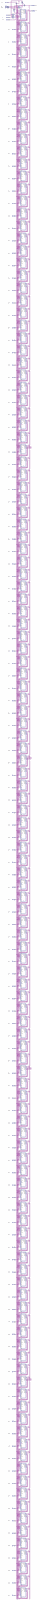
[diagram p0: schematic sheet, whole]
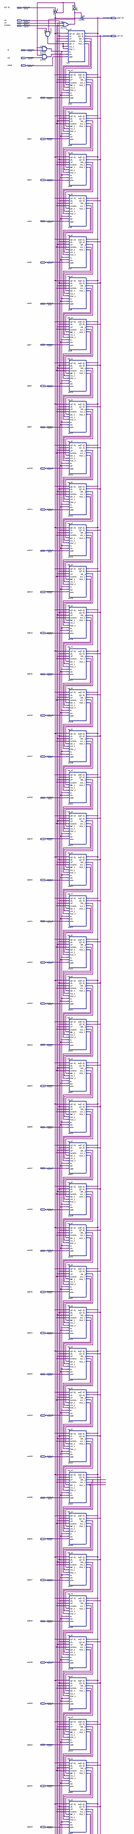
[diagram p1: schematic sheet, upper part]
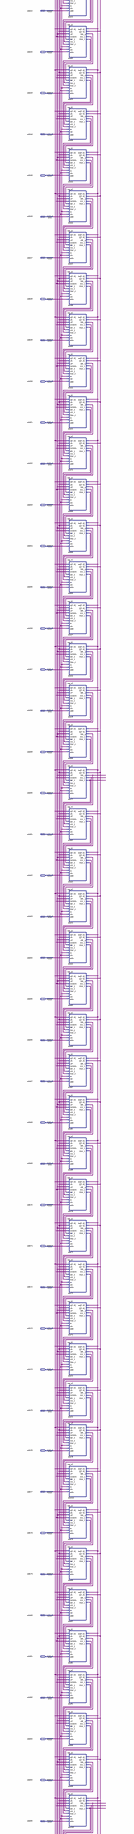
[diagram p2: schematic sheet, middle part]
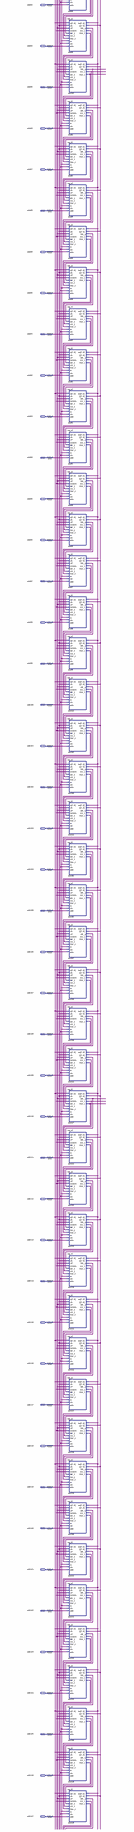
[diagram p3: schematic sheet, lower part]
// Quartus schematic rambuff.bdf as structural Verilog: 135 symbols, 136 pins
module rambuff (
  input  [7:0] in,
  input  clk,
  input  UP,
  input  DOWN,
  input  io,
  input  me,
  input  addr0,
  input  addr1,
  input  addr2,
  input  addr3,
  input  addr4,
  input  addr5,
  input  addr6,
  input  addr7,
  input  addr8,
  input  addr9,
  input  addr10,
  input  addr11,
  input  addr12,
  input  addr13,
  input  addr14,
  input  addr15,
  input  addr16,
  input  addr17,
  input  addr18,
  input  addr19,
  input  addr20,
  input  addr21,
  input  addr22,
  input  addr23,
  input  addr24,
  input  addr25,
  input  addr26,
  input  addr27,
  input  addr28,
  input  addr29,
  input  addr30,
  input  addr31,
  input  addr32,
  input  addr33,
  input  addr34,
  input  addr35,
  input  addr36,
  input  addr37,
  input  addr38,
  input  addr39,
  input  addr40,
  input  addr41,
  input  addr42,
  input  addr43,
  input  addr44,
  input  addr45,
  input  addr46,
  input  addr47,
  input  addr48,
  input  addr49,
  input  addr50,
  input  addr51,
  input  addr52,
  input  addr53,
  input  addr54,
  input  addr55,
  input  addr56,
  input  addr57,
  input  addr58,
  input  addr59,
  input  addr60,
  input  addr61,
  input  addr62,
  input  addr63,
  input  addr64,
  input  addr65,
  input  addr66,
  input  addr67,
  input  addr68,
  input  addr69,
  input  addr70,
  input  addr71,
  input  addr72,
  input  addr73,
  input  addr74,
  input  addr75,
  input  addr76,
  input  addr77,
  input  addr78,
  input  addr79,
  input  addr80,
  input  addr81,
  input  addr82,
  input  addr83,
  input  addr84,
  input  addr85,
  input  addr86,
  input  addr87,
  input  addr88,
  input  addr89,
  input  addr90,
  input  addr91,
  input  addr92,
  input  addr93,
  input  addr94,
  input  addr95,
  input  addr96,
  input  addr97,
  input  addr98,
  input  addr99,
  input  addr100,
  input  addr101,
  input  addr102,
  input  addr103,
  input  addr104,
  input  addr105,
  input  addr106,
  input  addr107,
  input  addr108,
  input  addr109,
  input  addr110,
  input  addr111,
  input  addr112,
  input  addr113,
  input  addr114,
  input  addr115,
  input  addr116,
  input  addr117,
  input  addr118,
  input  addr119,
  input  addr120,
  input  addr121,
  input  addr122,
  input  addr123,
  input  addr124,
  input  addr125,
  input  addr126,
  input  addr127,
  output [7:0] out,
  output [7:0] Q
);

  wire inst2_out, inst3_ad_1, inst3_me_1, inst3_rw_1, inst4_ad_1, inst4_me_1, inst4_rw_1, inst5_ad_1,
       inst5_me_1, inst5_rw_1, inst6_ad_1, inst6_me_1, inst6_rw_1, inst7_ad_1, inst7_me_1, inst7_rw_1,
       inst8_ad_1, inst8_me_1, inst8_rw_1, inst9_ad_1, inst9_me_1, inst9_rw_1, inst10_ad_1, inst10_me_1,
       inst10_rw_1, inst11_ad_1, inst11_me_1, inst11_rw_1, inst12_ad_1, inst12_me_1, inst12_rw_1,
       inst13_ad_1, inst13_me_1, inst13_rw_1, inst14_ad_1, inst14_me_1, inst14_rw_1, inst15_ad_1,
       inst15_me_1, inst15_rw_1, inst16_ad_1, inst16_me_1, inst16_rw_1, inst17_ad_1, inst17_me_1,
       inst17_rw_1, inst18_ad_1, inst18_me_1, inst18_rw_1, inst19_ad_1, inst19_me_1, inst19_rw_1,
       inst20_ad_1, inst20_me_1, inst20_rw_1, inst21_ad_1, inst21_me_1, inst21_rw_1, inst22_ad_1,
       inst22_me_1, inst22_rw_1, inst23_ad_1, inst23_me_1, inst23_rw_1, inst24_ad_1, inst24_me_1,
       inst24_rw_1, inst25_ad_1, inst25_me_1, inst25_rw_1, inst26_ad_1, inst26_me_1, inst26_rw_1,
       inst27_ad_1, inst27_me_1, inst27_rw_1, inst28_ad_1, inst28_me_1, inst28_rw_1, inst29_ad_1,
       inst29_me_1, inst29_rw_1, inst30_ad_1, inst30_me_1, inst30_rw_1, inst31_ad_1, inst31_me_1,
       inst31_rw_1, inst32_ad_1, inst32_me_1, inst32_rw_1, inst33_ad_1, inst33_me_1, inst33_rw_1,
       inst34_ad_1, inst34_me_1, inst34_rw_1, inst35_ad_1, inst35_me_1, inst35_rw_1, inst36_ad_1,
       inst36_me_1, inst36_rw_1, inst37_ad_1, inst37_me_1, inst37_rw_1, inst38_ad_1, inst38_me_1,
       inst38_rw_1, inst39_ad_1, inst39_me_1, inst39_rw_1, inst40_ad_1, inst40_me_1, inst40_rw_1,
       inst41_ad_1, inst41_me_1, inst41_rw_1, inst42_ad_1, inst42_me_1, inst42_rw_1, inst43_ad_1,
       inst43_me_1, inst43_rw_1, inst44_ad_1, inst44_me_1, inst44_rw_1, inst45_ad_1, inst45_me_1,
       inst45_rw_1, inst46_ad_1, inst46_me_1, inst46_rw_1, inst47_ad_1, inst47_me_1, inst47_rw_1,
       inst48_ad_1, inst48_me_1, inst48_rw_1, inst49_ad_1, inst49_me_1, inst49_rw_1, inst50_ad_1,
       inst50_me_1, inst50_rw_1, inst51_ad_1, inst51_me_1, inst51_rw_1, inst52_ad_1, inst52_me_1,
       inst52_rw_1, inst53_ad_1, inst53_me_1, inst53_rw_1, inst54_ad_1, inst54_me_1, inst54_rw_1,
       inst55_ad_1, inst55_me_1, inst55_rw_1, inst56_ad_1, inst56_me_1, inst56_rw_1, inst57_ad_1,
       inst57_me_1, inst57_rw_1, inst58_ad_1, inst58_me_1, inst58_rw_1, inst59_ad_1, inst59_me_1,
       inst59_rw_1, inst60_ad_1, inst60_me_1, inst60_rw_1, inst61_ad_1, inst61_me_1, inst61_rw_1,
       inst62_ad_1, inst62_me_1, inst62_rw_1, inst63_ad_1, inst63_me_1, inst63_rw_1, inst64_ad_1,
       inst64_me_1, inst64_rw_1, inst65_ad_1, inst65_me_1, inst65_rw_1, inst66_ad_1, inst66_me_1,
       inst66_rw_1, inst67_ad_1, inst67_me_1, inst67_rw_1, inst68_ad_1, inst68_me_1, inst68_rw_1,
       inst69_ad_1, inst69_me_1, inst69_rw_1, inst70_ad_1, inst70_me_1, inst70_rw_1, inst71_ad_1,
       inst71_me_1, inst71_rw_1, inst72_ad_1, inst72_me_1, inst72_rw_1, inst73_ad_1, inst73_me_1,
       inst73_rw_1, inst74_ad_1, inst74_me_1, inst74_rw_1, inst75_ad_1, inst75_me_1, inst75_rw_1,
       inst76_ad_1, inst76_me_1, inst76_rw_1, inst77_ad_1, inst77_me_1, inst77_rw_1, inst78_ad_1,
       inst78_me_1, inst78_rw_1, inst79_ad_1, inst79_me_1, inst79_rw_1, inst80_ad_1, inst80_me_1,
       inst80_rw_1, inst81_ad_1, inst81_me_1, inst81_rw_1, inst82_ad_1, inst82_me_1, inst82_rw_1,
       inst83_ad_1, inst83_me_1, inst83_rw_1, inst84_ad_1, inst84_me_1, inst84_rw_1, inst85_ad_1,
       inst85_me_1, inst85_rw_1, inst86_ad_1, inst86_me_1, inst86_rw_1, inst87_ad_1, inst87_me_1,
       inst87_rw_1, inst88_ad_1, inst88_me_1, inst88_rw_1, inst89_ad_1, inst89_me_1, inst89_rw_1,
       inst90_ad_1, inst90_me_1, inst90_rw_1, inst91_ad_1, inst91_me_1, inst91_rw_1, inst92_ad_1,
       inst92_me_1, inst92_rw_1, inst93_ad_1, inst93_me_1, inst93_rw_1, inst94_ad_1, inst94_me_1,
       inst94_rw_1, inst95_ad_1, inst95_me_1, inst95_rw_1, inst96_ad_1, inst96_me_1, inst96_rw_1,
       inst97_ad_1, inst97_me_1, inst97_rw_1, inst98_ad_1, inst98_me_1, inst98_rw_1, inst99_ad_1,
       inst99_me_1, inst99_rw_1, inst100_ad_1, inst100_me_1, inst100_rw_1, inst101_ad_1, inst101_me_1,
       inst101_rw_1, inst102_ad_1, inst102_me_1, inst102_rw_1, inst103_ad_1, inst103_me_1, inst103_rw_1,
       inst104_ad_1, inst104_me_1, inst104_rw_1, inst105_ad_1, inst105_me_1, inst105_rw_1, inst106_ad_1,
       inst106_me_1, inst106_rw_1, inst107_ad_1, inst107_me_1, inst107_rw_1, inst108_ad_1, inst108_me_1,
       inst108_rw_1, inst109_ad_1, inst109_me_1, inst109_rw_1, inst110_ad_1, inst110_me_1, inst110_rw_1,
       inst111_ad_1, inst111_me_1, inst111_rw_1, inst112_ad_1, inst112_me_1, inst112_rw_1, inst113_ad_1,
       inst113_me_1, inst113_rw_1, inst114_ad_1, inst114_me_1, inst114_rw_1, inst115_ad_1, inst115_me_1,
       inst115_rw_1, inst116_ad_1, inst116_me_1, inst116_rw_1, inst117_ad_1, inst117_me_1, inst117_rw_1,
       inst118_ad_1, inst118_me_1, inst118_rw_1, inst119_ad_1, inst119_me_1, inst119_rw_1, inst120_ad_1,
       inst120_me_1, inst120_rw_1, inst121_ad_1, inst121_me_1, inst121_rw_1, inst122_ad_1, inst122_me_1,
       inst122_rw_1, inst123_ad_1, inst123_me_1, inst123_rw_1, inst124_ad_1, inst124_me_1, inst124_rw_1,
       inst125_ad_1, inst125_me_1, inst125_rw_1, inst126_ad_1, inst126_me_1, inst126_rw_1, inst127_ad_1,
       inst127_me_1, inst127_rw_1, inst128_ad_1, inst128_me_1, inst128_rw_1, inst129_ad_1, inst129_me_1,
       inst129_rw_1, inst131_out, inst133_out, inst136_out, inst137_out, inst_ad_1, inst_me_1, inst_rw_1;
  wire [7:0] inst134_out;

  and inst2 (inst2_out, inst131_out, inst133_out);
  and inst136 (inst136_out, inst133_out, io);
  and inst137 (inst137_out, inst133_out, me);
  TRI inst134[7:0] (.IN(in), .OE(inst133_out), .OUT(inst134_out));
  or inst131 (inst131_out, UP, DOWN);
  not inst133 (inst133_out, inst131_out);
  tag_e1 inst (
    .in(inst134_out), .clk(clk), .UP(UP), .DOWN(DOWN), .ME_2(inst2_out), .AD_2(inst2_out), .RW_2(inst2_out),
    .io(inst136_out), .me(inst137_out), .addr(addr0), .out(out), .Q(Q), .ME_1(inst_me_1), .AD_1(inst_ad_1),
    .RW_1(inst_rw_1));
  tag_e1 inst3 (
    .in(inst134_out), .clk(clk), .UP(UP), .DOWN(DOWN), .ME_2(inst_me_1), .AD_2(inst_ad_1), .RW_2(inst_rw_1),
    .io(inst136_out), .me(inst137_out), .addr(addr1), .out(out), .Q(Q), .ME_1(inst3_me_1), .AD_1(inst3_ad_1),
    .RW_1(inst3_rw_1));
  tag_e1 inst4 (
    .in(inst134_out), .clk(clk), .UP(UP), .DOWN(DOWN), .ME_2(inst3_me_1), .AD_2(inst3_ad_1),
    .RW_2(inst3_rw_1), .io(inst136_out), .me(inst137_out), .addr(addr2), .out(out), .Q(Q), .ME_1(inst4_me_1),
    .AD_1(inst4_ad_1), .RW_1(inst4_rw_1));
  tag_e1 inst5 (
    .in(inst134_out), .clk(clk), .UP(UP), .DOWN(DOWN), .ME_2(inst4_me_1), .AD_2(inst4_ad_1),
    .RW_2(inst4_rw_1), .io(inst136_out), .me(inst137_out), .addr(addr3), .out(out), .Q(Q), .ME_1(inst5_me_1),
    .AD_1(inst5_ad_1), .RW_1(inst5_rw_1));
  tag_e1 inst6 (
    .in(inst134_out), .clk(clk), .UP(UP), .DOWN(DOWN), .ME_2(inst5_me_1), .AD_2(inst5_ad_1),
    .RW_2(inst5_rw_1), .io(inst136_out), .me(inst137_out), .addr(addr4), .out(out), .Q(Q), .ME_1(inst6_me_1),
    .AD_1(inst6_ad_1), .RW_1(inst6_rw_1));
  tag_e1 inst7 (
    .in(inst134_out), .clk(clk), .UP(UP), .DOWN(DOWN), .ME_2(inst6_me_1), .AD_2(inst6_ad_1),
    .RW_2(inst6_rw_1), .io(inst136_out), .me(inst137_out), .addr(addr5), .out(out), .Q(Q), .ME_1(inst7_me_1),
    .AD_1(inst7_ad_1), .RW_1(inst7_rw_1));
  tag_e1 inst8 (
    .in(inst134_out), .clk(clk), .UP(UP), .DOWN(DOWN), .ME_2(inst7_me_1), .AD_2(inst7_ad_1),
    .RW_2(inst7_rw_1), .io(inst136_out), .me(inst137_out), .addr(addr6), .out(out), .Q(Q), .ME_1(inst8_me_1),
    .AD_1(inst8_ad_1), .RW_1(inst8_rw_1));
  tag_e1 inst9 (
    .in(inst134_out), .clk(clk), .UP(UP), .DOWN(DOWN), .ME_2(inst8_me_1), .AD_2(inst8_ad_1),
    .RW_2(inst8_rw_1), .io(inst136_out), .me(inst137_out), .addr(addr7), .out(out), .Q(Q), .ME_1(inst9_me_1),
    .AD_1(inst9_ad_1), .RW_1(inst9_rw_1));
  tag_e1 inst10 (
    .in(inst134_out), .clk(clk), .UP(UP), .DOWN(DOWN), .ME_2(inst9_me_1), .AD_2(inst9_ad_1),
    .RW_2(inst9_rw_1), .io(inst136_out), .me(inst137_out), .addr(addr8), .out(out), .Q(Q),
    .ME_1(inst10_me_1), .AD_1(inst10_ad_1), .RW_1(inst10_rw_1));
  tag_e1 inst11 (
    .in(inst134_out), .clk(clk), .UP(UP), .DOWN(DOWN), .ME_2(inst10_me_1), .AD_2(inst10_ad_1),
    .RW_2(inst10_rw_1), .io(inst136_out), .me(inst137_out), .addr(addr9), .out(out), .Q(Q),
    .ME_1(inst11_me_1), .AD_1(inst11_ad_1), .RW_1(inst11_rw_1));
  tag_e1 inst12 (
    .in(inst134_out), .clk(clk), .UP(UP), .DOWN(DOWN), .ME_2(inst11_me_1), .AD_2(inst11_ad_1),
    .RW_2(inst11_rw_1), .io(inst136_out), .me(inst137_out), .addr(addr10), .out(out), .Q(Q),
    .ME_1(inst12_me_1), .AD_1(inst12_ad_1), .RW_1(inst12_rw_1));
  tag_e1 inst13 (
    .in(inst134_out), .clk(clk), .UP(UP), .DOWN(DOWN), .ME_2(inst12_me_1), .AD_2(inst12_ad_1),
    .RW_2(inst12_rw_1), .io(inst136_out), .me(inst137_out), .addr(addr11), .out(out), .Q(Q),
    .ME_1(inst13_me_1), .AD_1(inst13_ad_1), .RW_1(inst13_rw_1));
  tag_e1 inst14 (
    .in(inst134_out), .clk(clk), .UP(UP), .DOWN(DOWN), .ME_2(inst13_me_1), .AD_2(inst13_ad_1),
    .RW_2(inst13_rw_1), .io(inst136_out), .me(inst137_out), .addr(addr12), .out(out), .Q(Q),
    .ME_1(inst14_me_1), .AD_1(inst14_ad_1), .RW_1(inst14_rw_1));
  tag_e1 inst15 (
    .in(inst134_out), .clk(clk), .UP(UP), .DOWN(DOWN), .ME_2(inst14_me_1), .AD_2(inst14_ad_1),
    .RW_2(inst14_rw_1), .io(inst136_out), .me(inst137_out), .addr(addr13), .out(out), .Q(Q),
    .ME_1(inst15_me_1), .AD_1(inst15_ad_1), .RW_1(inst15_rw_1));
  tag_e1 inst16 (
    .in(inst134_out), .clk(clk), .UP(UP), .DOWN(DOWN), .ME_2(inst15_me_1), .AD_2(inst15_ad_1),
    .RW_2(inst15_rw_1), .io(inst136_out), .me(inst137_out), .addr(addr14), .out(out), .Q(Q),
    .ME_1(inst16_me_1), .AD_1(inst16_ad_1), .RW_1(inst16_rw_1));
  tag_e1 inst17 (
    .in(inst134_out), .clk(clk), .UP(UP), .DOWN(DOWN), .ME_2(inst16_me_1), .AD_2(inst16_ad_1),
    .RW_2(inst16_rw_1), .io(inst136_out), .me(inst137_out), .addr(addr15), .out(out), .Q(Q),
    .ME_1(inst17_me_1), .AD_1(inst17_ad_1), .RW_1(inst17_rw_1));
  tag_e1 inst18 (
    .in(inst134_out), .clk(clk), .UP(UP), .DOWN(DOWN), .ME_2(inst17_me_1), .AD_2(inst17_ad_1),
    .RW_2(inst17_rw_1), .io(inst136_out), .me(inst137_out), .addr(addr16), .out(out), .Q(Q),
    .ME_1(inst18_me_1), .AD_1(inst18_ad_1), .RW_1(inst18_rw_1));
  tag_e1 inst19 (
    .in(inst134_out), .clk(clk), .UP(UP), .DOWN(DOWN), .ME_2(inst18_me_1), .AD_2(inst18_ad_1),
    .RW_2(inst18_rw_1), .io(inst136_out), .me(inst137_out), .addr(addr17), .out(out), .Q(Q),
    .ME_1(inst19_me_1), .AD_1(inst19_ad_1), .RW_1(inst19_rw_1));
  tag_e1 inst20 (
    .in(inst134_out), .clk(clk), .UP(UP), .DOWN(DOWN), .ME_2(inst19_me_1), .AD_2(inst19_ad_1),
    .RW_2(inst19_rw_1), .io(inst136_out), .me(inst137_out), .addr(addr18), .out(out), .Q(Q),
    .ME_1(inst20_me_1), .AD_1(inst20_ad_1), .RW_1(inst20_rw_1));
  tag_e1 inst21 (
    .in(inst134_out), .clk(clk), .UP(UP), .DOWN(DOWN), .ME_2(inst20_me_1), .AD_2(inst20_ad_1),
    .RW_2(inst20_rw_1), .io(inst136_out), .me(inst137_out), .addr(addr19), .out(out), .Q(Q),
    .ME_1(inst21_me_1), .AD_1(inst21_ad_1), .RW_1(inst21_rw_1));
  tag_e1 inst22 (
    .in(inst134_out), .clk(clk), .UP(UP), .DOWN(DOWN), .ME_2(inst21_me_1), .AD_2(inst21_ad_1),
    .RW_2(inst21_rw_1), .io(inst136_out), .me(inst137_out), .addr(addr20), .out(out), .Q(Q),
    .ME_1(inst22_me_1), .AD_1(inst22_ad_1), .RW_1(inst22_rw_1));
  tag_e1 inst23 (
    .in(inst134_out), .clk(clk), .UP(UP), .DOWN(DOWN), .ME_2(inst22_me_1), .AD_2(inst22_ad_1),
    .RW_2(inst22_rw_1), .io(inst136_out), .me(inst137_out), .addr(addr21), .out(out), .Q(Q),
    .ME_1(inst23_me_1), .AD_1(inst23_ad_1), .RW_1(inst23_rw_1));
  tag_e1 inst24 (
    .in(inst134_out), .clk(clk), .UP(UP), .DOWN(DOWN), .ME_2(inst23_me_1), .AD_2(inst23_ad_1),
    .RW_2(inst23_rw_1), .io(inst136_out), .me(inst137_out), .addr(addr22), .out(out), .Q(Q),
    .ME_1(inst24_me_1), .AD_1(inst24_ad_1), .RW_1(inst24_rw_1));
  tag_e1 inst25 (
    .in(inst134_out), .clk(clk), .UP(UP), .DOWN(DOWN), .ME_2(inst24_me_1), .AD_2(inst24_ad_1),
    .RW_2(inst24_rw_1), .io(inst136_out), .me(inst137_out), .addr(addr23), .out(out), .Q(Q),
    .ME_1(inst25_me_1), .AD_1(inst25_ad_1), .RW_1(inst25_rw_1));
  tag_e1 inst26 (
    .in(inst134_out), .clk(clk), .UP(UP), .DOWN(DOWN), .ME_2(inst25_me_1), .AD_2(inst25_ad_1),
    .RW_2(inst25_rw_1), .io(inst136_out), .me(inst137_out), .addr(addr24), .out(out), .Q(Q),
    .ME_1(inst26_me_1), .AD_1(inst26_ad_1), .RW_1(inst26_rw_1));
  tag_e1 inst27 (
    .in(inst134_out), .clk(clk), .UP(UP), .DOWN(DOWN), .ME_2(inst26_me_1), .AD_2(inst26_ad_1),
    .RW_2(inst26_rw_1), .io(inst136_out), .me(inst137_out), .addr(addr25), .out(out), .Q(Q),
    .ME_1(inst27_me_1), .AD_1(inst27_ad_1), .RW_1(inst27_rw_1));
  tag_e1 inst28 (
    .in(inst134_out), .clk(clk), .UP(UP), .DOWN(DOWN), .ME_2(inst27_me_1), .AD_2(inst27_ad_1),
    .RW_2(inst27_rw_1), .io(inst136_out), .me(inst137_out), .addr(addr26), .out(out), .Q(Q),
    .ME_1(inst28_me_1), .AD_1(inst28_ad_1), .RW_1(inst28_rw_1));
  tag_e1 inst51 (
    .in(inst134_out), .clk(clk), .UP(UP), .DOWN(DOWN), .ME_2(inst28_me_1), .AD_2(inst28_ad_1),
    .RW_2(inst28_rw_1), .io(inst136_out), .me(inst137_out), .addr(addr27), .out(out), .Q(Q),
    .ME_1(inst51_me_1), .AD_1(inst51_ad_1), .RW_1(inst51_rw_1));
  tag_e1 inst29 (
    .in(inst134_out), .clk(clk), .UP(UP), .DOWN(DOWN), .ME_2(inst51_me_1), .AD_2(inst51_ad_1),
    .RW_2(inst51_rw_1), .io(inst136_out), .me(inst137_out), .addr(addr28), .out(out), .Q(Q),
    .ME_1(inst29_me_1), .AD_1(inst29_ad_1), .RW_1(inst29_rw_1));
  tag_e1 inst30 (
    .in(inst134_out), .clk(clk), .UP(UP), .DOWN(DOWN), .ME_2(inst29_me_1), .AD_2(inst29_ad_1),
    .RW_2(inst29_rw_1), .io(inst136_out), .me(inst137_out), .addr(addr29), .out(out), .Q(Q),
    .ME_1(inst30_me_1), .AD_1(inst30_ad_1), .RW_1(inst30_rw_1));
  tag_e1 inst31 (
    .in(inst134_out), .clk(clk), .UP(UP), .DOWN(DOWN), .ME_2(inst30_me_1), .AD_2(inst30_ad_1),
    .RW_2(inst30_rw_1), .io(inst136_out), .me(inst137_out), .addr(addr30), .out(out), .Q(Q),
    .ME_1(inst31_me_1), .AD_1(inst31_ad_1), .RW_1(inst31_rw_1));
  tag_e1 inst32 (
    .in(inst134_out), .clk(clk), .UP(UP), .DOWN(DOWN), .ME_2(inst31_me_1), .AD_2(inst31_ad_1),
    .RW_2(inst31_rw_1), .io(inst136_out), .me(inst137_out), .addr(addr31), .out(out), .Q(Q),
    .ME_1(inst32_me_1), .AD_1(inst32_ad_1), .RW_1(inst32_rw_1));
  tag_e1 inst33 (
    .in(inst134_out), .clk(clk), .UP(UP), .DOWN(DOWN), .ME_2(inst32_me_1), .AD_2(inst32_ad_1),
    .RW_2(inst32_rw_1), .io(inst136_out), .me(inst137_out), .addr(addr32), .out(out), .Q(Q),
    .ME_1(inst33_me_1), .AD_1(inst33_ad_1), .RW_1(inst33_rw_1));
  tag_e1 inst34 (
    .in(inst134_out), .clk(clk), .UP(UP), .DOWN(DOWN), .ME_2(inst33_me_1), .AD_2(inst33_ad_1),
    .RW_2(inst33_rw_1), .io(inst136_out), .me(inst137_out), .addr(addr33), .out(out), .Q(Q),
    .ME_1(inst34_me_1), .AD_1(inst34_ad_1), .RW_1(inst34_rw_1));
  tag_e1 inst35 (
    .in(inst134_out), .clk(clk), .UP(UP), .DOWN(DOWN), .ME_2(inst34_me_1), .AD_2(inst34_ad_1),
    .RW_2(inst34_rw_1), .io(inst136_out), .me(inst137_out), .addr(addr34), .out(out), .Q(Q),
    .ME_1(inst35_me_1), .AD_1(inst35_ad_1), .RW_1(inst35_rw_1));
  tag_e1 inst52 (
    .in(inst134_out), .clk(clk), .UP(UP), .DOWN(DOWN), .ME_2(inst35_me_1), .AD_2(inst35_ad_1),
    .RW_2(inst35_rw_1), .io(inst136_out), .me(inst137_out), .addr(addr35), .out(out), .Q(Q),
    .ME_1(inst52_me_1), .AD_1(inst52_ad_1), .RW_1(inst52_rw_1));
  tag_e1 inst36 (
    .in(inst134_out), .clk(clk), .UP(UP), .DOWN(DOWN), .ME_2(inst52_me_1), .AD_2(inst52_ad_1),
    .RW_2(inst52_rw_1), .io(inst136_out), .me(inst137_out), .addr(addr36), .out(out), .Q(Q),
    .ME_1(inst36_me_1), .AD_1(inst36_ad_1), .RW_1(inst36_rw_1));
  tag_e1 inst37 (
    .in(inst134_out), .clk(clk), .UP(UP), .DOWN(DOWN), .ME_2(inst36_me_1), .AD_2(inst36_ad_1),
    .RW_2(inst36_rw_1), .io(inst136_out), .me(inst137_out), .addr(addr37), .out(out), .Q(Q),
    .ME_1(inst37_me_1), .AD_1(inst37_ad_1), .RW_1(inst37_rw_1));
  tag_e1 inst38 (
    .in(inst134_out), .clk(clk), .UP(UP), .DOWN(DOWN), .ME_2(inst37_me_1), .AD_2(inst37_ad_1),
    .RW_2(inst37_rw_1), .io(inst136_out), .me(inst137_out), .addr(addr38), .out(out), .Q(Q),
    .ME_1(inst38_me_1), .AD_1(inst38_ad_1), .RW_1(inst38_rw_1));
  tag_e1 inst39 (
    .in(inst134_out), .clk(clk), .UP(UP), .DOWN(DOWN), .ME_2(inst38_me_1), .AD_2(inst38_ad_1),
    .RW_2(inst38_rw_1), .io(inst136_out), .me(inst137_out), .addr(addr39), .out(out), .Q(Q),
    .ME_1(inst39_me_1), .AD_1(inst39_ad_1), .RW_1(inst39_rw_1));
  tag_e1 inst40 (
    .in(inst134_out), .clk(clk), .UP(UP), .DOWN(DOWN), .ME_2(inst39_me_1), .AD_2(inst39_ad_1),
    .RW_2(inst39_rw_1), .io(inst136_out), .me(inst137_out), .addr(addr40), .out(out), .Q(Q),
    .ME_1(inst40_me_1), .AD_1(inst40_ad_1), .RW_1(inst40_rw_1));
  tag_e1 inst41 (
    .in(inst134_out), .clk(clk), .UP(UP), .DOWN(DOWN), .ME_2(inst40_me_1), .AD_2(inst40_ad_1),
    .RW_2(inst40_rw_1), .io(inst136_out), .me(inst137_out), .addr(addr41), .out(out), .Q(Q),
    .ME_1(inst41_me_1), .AD_1(inst41_ad_1), .RW_1(inst41_rw_1));
  tag_e1 inst42 (
    .in(inst134_out), .clk(clk), .UP(UP), .DOWN(DOWN), .ME_2(inst41_me_1), .AD_2(inst41_ad_1),
    .RW_2(inst41_rw_1), .io(inst136_out), .me(inst137_out), .addr(addr42), .out(out), .Q(Q),
    .ME_1(inst42_me_1), .AD_1(inst42_ad_1), .RW_1(inst42_rw_1));
  tag_e1 inst43 (
    .in(inst134_out), .clk(clk), .UP(UP), .DOWN(DOWN), .ME_2(inst42_me_1), .AD_2(inst42_ad_1),
    .RW_2(inst42_rw_1), .io(inst136_out), .me(inst137_out), .addr(addr43), .out(out), .Q(Q),
    .ME_1(inst43_me_1), .AD_1(inst43_ad_1), .RW_1(inst43_rw_1));
  tag_e1 inst44 (
    .in(inst134_out), .clk(clk), .UP(UP), .DOWN(DOWN), .ME_2(inst43_me_1), .AD_2(inst43_ad_1),
    .RW_2(inst43_rw_1), .io(inst136_out), .me(inst137_out), .addr(addr44), .out(out), .Q(Q),
    .ME_1(inst44_me_1), .AD_1(inst44_ad_1), .RW_1(inst44_rw_1));
  tag_e1 inst45 (
    .in(inst134_out), .clk(clk), .UP(UP), .DOWN(DOWN), .ME_2(inst44_me_1), .AD_2(inst44_ad_1),
    .RW_2(inst44_rw_1), .io(inst136_out), .me(inst137_out), .addr(addr45), .out(out), .Q(Q),
    .ME_1(inst45_me_1), .AD_1(inst45_ad_1), .RW_1(inst45_rw_1));
  tag_e1 inst46 (
    .in(inst134_out), .clk(clk), .UP(UP), .DOWN(DOWN), .ME_2(inst45_me_1), .AD_2(inst45_ad_1),
    .RW_2(inst45_rw_1), .io(inst136_out), .me(inst137_out), .addr(addr46), .out(out), .Q(Q),
    .ME_1(inst46_me_1), .AD_1(inst46_ad_1), .RW_1(inst46_rw_1));
  tag_e1 inst47 (
    .in(inst134_out), .clk(clk), .UP(UP), .DOWN(DOWN), .ME_2(inst46_me_1), .AD_2(inst46_ad_1),
    .RW_2(inst46_rw_1), .io(inst136_out), .me(inst137_out), .addr(addr47), .out(out), .Q(Q),
    .ME_1(inst47_me_1), .AD_1(inst47_ad_1), .RW_1(inst47_rw_1));
  tag_e1 inst48 (
    .in(inst134_out), .clk(clk), .UP(UP), .DOWN(DOWN), .ME_2(inst47_me_1), .AD_2(inst47_ad_1),
    .RW_2(inst47_rw_1), .io(inst136_out), .me(inst137_out), .addr(addr48), .out(out), .Q(Q),
    .ME_1(inst48_me_1), .AD_1(inst48_ad_1), .RW_1(inst48_rw_1));
  tag_e1 inst49 (
    .in(inst134_out), .clk(clk), .UP(UP), .DOWN(DOWN), .ME_2(inst48_me_1), .AD_2(inst48_ad_1),
    .RW_2(inst48_rw_1), .io(inst136_out), .me(inst137_out), .addr(addr49), .out(out), .Q(Q),
    .ME_1(inst49_me_1), .AD_1(inst49_ad_1), .RW_1(inst49_rw_1));
  tag_e1 inst50 (
    .in(inst134_out), .clk(clk), .UP(UP), .DOWN(DOWN), .ME_2(inst49_me_1), .AD_2(inst49_ad_1),
    .RW_2(inst49_rw_1), .io(inst136_out), .me(inst137_out), .addr(addr50), .out(out), .Q(Q),
    .ME_1(inst50_me_1), .AD_1(inst50_ad_1), .RW_1(inst50_rw_1));
  tag_e1 inst53 (
    .in(inst134_out), .clk(clk), .UP(UP), .DOWN(DOWN), .ME_2(inst50_me_1), .AD_2(inst50_ad_1),
    .RW_2(inst50_rw_1), .io(inst136_out), .me(inst137_out), .addr(addr51), .out(out), .Q(Q),
    .ME_1(inst53_me_1), .AD_1(inst53_ad_1), .RW_1(inst53_rw_1));
  tag_e1 inst76 (
    .in(inst134_out), .clk(clk), .UP(UP), .DOWN(DOWN), .ME_2(inst53_me_1), .AD_2(inst53_ad_1),
    .RW_2(inst53_rw_1), .io(inst136_out), .me(inst137_out), .addr(addr52), .out(out), .Q(Q),
    .ME_1(inst76_me_1), .AD_1(inst76_ad_1), .RW_1(inst76_rw_1));
  tag_e1 inst54 (
    .in(inst134_out), .clk(clk), .UP(UP), .DOWN(DOWN), .ME_2(inst76_me_1), .AD_2(inst76_ad_1),
    .RW_2(inst76_rw_1), .io(inst136_out), .me(inst137_out), .addr(addr53), .out(out), .Q(Q),
    .ME_1(inst54_me_1), .AD_1(inst54_ad_1), .RW_1(inst54_rw_1));
  tag_e1 inst55 (
    .in(inst134_out), .clk(clk), .UP(UP), .DOWN(DOWN), .ME_2(inst54_me_1), .AD_2(inst54_ad_1),
    .RW_2(inst54_rw_1), .io(inst136_out), .me(inst137_out), .addr(addr54), .out(out), .Q(Q),
    .ME_1(inst55_me_1), .AD_1(inst55_ad_1), .RW_1(inst55_rw_1));
  tag_e1 inst56 (
    .in(inst134_out), .clk(clk), .UP(UP), .DOWN(DOWN), .ME_2(inst55_me_1), .AD_2(inst55_ad_1),
    .RW_2(inst55_rw_1), .io(inst136_out), .me(inst137_out), .addr(addr55), .out(out), .Q(Q),
    .ME_1(inst56_me_1), .AD_1(inst56_ad_1), .RW_1(inst56_rw_1));
  tag_e1 inst57 (
    .in(inst134_out), .clk(clk), .UP(UP), .DOWN(DOWN), .ME_2(inst56_me_1), .AD_2(inst56_ad_1),
    .RW_2(inst56_rw_1), .io(inst136_out), .me(inst137_out), .addr(addr56), .out(out), .Q(Q),
    .ME_1(inst57_me_1), .AD_1(inst57_ad_1), .RW_1(inst57_rw_1));
  tag_e1 inst58 (
    .in(inst134_out), .clk(clk), .UP(UP), .DOWN(DOWN), .ME_2(inst57_me_1), .AD_2(inst57_ad_1),
    .RW_2(inst57_rw_1), .io(inst136_out), .me(inst137_out), .addr(addr57), .out(out), .Q(Q),
    .ME_1(inst58_me_1), .AD_1(inst58_ad_1), .RW_1(inst58_rw_1));
  tag_e1 inst59 (
    .in(inst134_out), .clk(clk), .UP(UP), .DOWN(DOWN), .ME_2(inst58_me_1), .AD_2(inst58_ad_1),
    .RW_2(inst58_rw_1), .io(inst136_out), .me(inst137_out), .addr(addr58), .out(out), .Q(Q),
    .ME_1(inst59_me_1), .AD_1(inst59_ad_1), .RW_1(inst59_rw_1));
  tag_e1 inst60 (
    .in(inst134_out), .clk(clk), .UP(UP), .DOWN(DOWN), .ME_2(inst59_me_1), .AD_2(inst59_ad_1),
    .RW_2(inst59_rw_1), .io(inst136_out), .me(inst137_out), .addr(addr59), .out(out), .Q(Q),
    .ME_1(inst60_me_1), .AD_1(inst60_ad_1), .RW_1(inst60_rw_1));
  tag_e1 inst77 (
    .in(inst134_out), .clk(clk), .UP(UP), .DOWN(DOWN), .ME_2(inst60_me_1), .AD_2(inst60_ad_1),
    .RW_2(inst60_rw_1), .io(inst136_out), .me(inst137_out), .addr(addr60), .out(out), .Q(Q),
    .ME_1(inst77_me_1), .AD_1(inst77_ad_1), .RW_1(inst77_rw_1));
  tag_e1 inst61 (
    .in(inst134_out), .clk(clk), .UP(UP), .DOWN(DOWN), .ME_2(inst77_me_1), .AD_2(inst77_ad_1),
    .RW_2(inst77_rw_1), .io(inst136_out), .me(inst137_out), .addr(addr61), .out(out), .Q(Q),
    .ME_1(inst61_me_1), .AD_1(inst61_ad_1), .RW_1(inst61_rw_1));
  tag_e1 inst62 (
    .in(inst134_out), .clk(clk), .UP(UP), .DOWN(DOWN), .ME_2(inst61_me_1), .AD_2(inst61_ad_1),
    .RW_2(inst61_rw_1), .io(inst136_out), .me(inst137_out), .addr(addr62), .out(out), .Q(Q),
    .ME_1(inst62_me_1), .AD_1(inst62_ad_1), .RW_1(inst62_rw_1));
  tag_e1 inst63 (
    .in(inst134_out), .clk(clk), .UP(UP), .DOWN(DOWN), .ME_2(inst62_me_1), .AD_2(inst62_ad_1),
    .RW_2(inst62_rw_1), .io(inst136_out), .me(inst137_out), .addr(addr63), .out(out), .Q(Q),
    .ME_1(inst63_me_1), .AD_1(inst63_ad_1), .RW_1(inst63_rw_1));
  tag_e1 inst64 (
    .in(inst134_out), .clk(clk), .UP(UP), .DOWN(DOWN), .ME_2(inst63_me_1), .AD_2(inst63_ad_1),
    .RW_2(inst63_rw_1), .io(inst136_out), .me(inst137_out), .addr(addr64), .out(out), .Q(Q),
    .ME_1(inst64_me_1), .AD_1(inst64_ad_1), .RW_1(inst64_rw_1));
  tag_e1 inst65 (
    .in(inst134_out), .clk(clk), .UP(UP), .DOWN(DOWN), .ME_2(inst64_me_1), .AD_2(inst64_ad_1),
    .RW_2(inst64_rw_1), .io(inst136_out), .me(inst137_out), .addr(addr65), .out(out), .Q(Q),
    .ME_1(inst65_me_1), .AD_1(inst65_ad_1), .RW_1(inst65_rw_1));
  tag_e1 inst66 (
    .in(inst134_out), .clk(clk), .UP(UP), .DOWN(DOWN), .ME_2(inst65_me_1), .AD_2(inst65_ad_1),
    .RW_2(inst65_rw_1), .io(inst136_out), .me(inst137_out), .addr(addr66), .out(out), .Q(Q),
    .ME_1(inst66_me_1), .AD_1(inst66_ad_1), .RW_1(inst66_rw_1));
  tag_e1 inst67 (
    .in(inst134_out), .clk(clk), .UP(UP), .DOWN(DOWN), .ME_2(inst66_me_1), .AD_2(inst66_ad_1),
    .RW_2(inst66_rw_1), .io(inst136_out), .me(inst137_out), .addr(addr67), .out(out), .Q(Q),
    .ME_1(inst67_me_1), .AD_1(inst67_ad_1), .RW_1(inst67_rw_1));
  tag_e1 inst68 (
    .in(inst134_out), .clk(clk), .UP(UP), .DOWN(DOWN), .ME_2(inst67_me_1), .AD_2(inst67_ad_1),
    .RW_2(inst67_rw_1), .io(inst136_out), .me(inst137_out), .addr(addr68), .out(out), .Q(Q),
    .ME_1(inst68_me_1), .AD_1(inst68_ad_1), .RW_1(inst68_rw_1));
  tag_e1 inst69 (
    .in(inst134_out), .clk(clk), .UP(UP), .DOWN(DOWN), .ME_2(inst68_me_1), .AD_2(inst68_ad_1),
    .RW_2(inst68_rw_1), .io(inst136_out), .me(inst137_out), .addr(addr69), .out(out), .Q(Q),
    .ME_1(inst69_me_1), .AD_1(inst69_ad_1), .RW_1(inst69_rw_1));
  tag_e1 inst70 (
    .in(inst134_out), .clk(clk), .UP(UP), .DOWN(DOWN), .ME_2(inst69_me_1), .AD_2(inst69_ad_1),
    .RW_2(inst69_rw_1), .io(inst136_out), .me(inst137_out), .addr(addr70), .out(out), .Q(Q),
    .ME_1(inst70_me_1), .AD_1(inst70_ad_1), .RW_1(inst70_rw_1));
  tag_e1 inst71 (
    .in(inst134_out), .clk(clk), .UP(UP), .DOWN(DOWN), .ME_2(inst70_me_1), .AD_2(inst70_ad_1),
    .RW_2(inst70_rw_1), .io(inst136_out), .me(inst137_out), .addr(addr71), .out(out), .Q(Q),
    .ME_1(inst71_me_1), .AD_1(inst71_ad_1), .RW_1(inst71_rw_1));
  tag_e1 inst72 (
    .in(inst134_out), .clk(clk), .UP(UP), .DOWN(DOWN), .ME_2(inst71_me_1), .AD_2(inst71_ad_1),
    .RW_2(inst71_rw_1), .io(inst136_out), .me(inst137_out), .addr(addr72), .out(out), .Q(Q),
    .ME_1(inst72_me_1), .AD_1(inst72_ad_1), .RW_1(inst72_rw_1));
  tag_e1 inst73 (
    .in(inst134_out), .clk(clk), .UP(UP), .DOWN(DOWN), .ME_2(inst72_me_1), .AD_2(inst72_ad_1),
    .RW_2(inst72_rw_1), .io(inst136_out), .me(inst137_out), .addr(addr73), .out(out), .Q(Q),
    .ME_1(inst73_me_1), .AD_1(inst73_ad_1), .RW_1(inst73_rw_1));
  tag_e1 inst74 (
    .in(inst134_out), .clk(clk), .UP(UP), .DOWN(DOWN), .ME_2(inst73_me_1), .AD_2(inst73_ad_1),
    .RW_2(inst73_rw_1), .io(inst136_out), .me(inst137_out), .addr(addr74), .out(out), .Q(Q),
    .ME_1(inst74_me_1), .AD_1(inst74_ad_1), .RW_1(inst74_rw_1));
  tag_e1 inst75 (
    .in(inst134_out), .clk(clk), .UP(UP), .DOWN(DOWN), .ME_2(inst74_me_1), .AD_2(inst74_ad_1),
    .RW_2(inst74_rw_1), .io(inst136_out), .me(inst137_out), .addr(addr75), .out(out), .Q(Q),
    .ME_1(inst75_me_1), .AD_1(inst75_ad_1), .RW_1(inst75_rw_1));
  tag_e1 inst78 (
    .in(inst134_out), .clk(clk), .UP(UP), .DOWN(DOWN), .ME_2(inst75_me_1), .AD_2(inst75_ad_1),
    .RW_2(inst75_rw_1), .io(inst136_out), .me(inst137_out), .addr(addr76), .out(out), .Q(Q),
    .ME_1(inst78_me_1), .AD_1(inst78_ad_1), .RW_1(inst78_rw_1));
  tag_e1 inst101 (
    .in(inst134_out), .clk(clk), .UP(UP), .DOWN(DOWN), .ME_2(inst78_me_1), .AD_2(inst78_ad_1),
    .RW_2(inst78_rw_1), .io(inst136_out), .me(inst137_out), .addr(addr77), .out(out), .Q(Q),
    .ME_1(inst101_me_1), .AD_1(inst101_ad_1), .RW_1(inst101_rw_1));
  tag_e1 inst79 (
    .in(inst134_out), .clk(clk), .UP(UP), .DOWN(DOWN), .ME_2(inst101_me_1), .AD_2(inst101_ad_1),
    .RW_2(inst101_rw_1), .io(inst136_out), .me(inst137_out), .addr(addr78), .out(out), .Q(Q),
    .ME_1(inst79_me_1), .AD_1(inst79_ad_1), .RW_1(inst79_rw_1));
  tag_e1 inst80 (
    .in(inst134_out), .clk(clk), .UP(UP), .DOWN(DOWN), .ME_2(inst79_me_1), .AD_2(inst79_ad_1),
    .RW_2(inst79_rw_1), .io(inst136_out), .me(inst137_out), .addr(addr79), .out(out), .Q(Q),
    .ME_1(inst80_me_1), .AD_1(inst80_ad_1), .RW_1(inst80_rw_1));
  tag_e1 inst81 (
    .in(inst134_out), .clk(clk), .UP(UP), .DOWN(DOWN), .ME_2(inst80_me_1), .AD_2(inst80_ad_1),
    .RW_2(inst80_rw_1), .io(inst136_out), .me(inst137_out), .addr(addr80), .out(out), .Q(Q),
    .ME_1(inst81_me_1), .AD_1(inst81_ad_1), .RW_1(inst81_rw_1));
  tag_e1 inst82 (
    .in(inst134_out), .clk(clk), .UP(UP), .DOWN(DOWN), .ME_2(inst81_me_1), .AD_2(inst81_ad_1),
    .RW_2(inst81_rw_1), .io(inst136_out), .me(inst137_out), .addr(addr81), .out(out), .Q(Q),
    .ME_1(inst82_me_1), .AD_1(inst82_ad_1), .RW_1(inst82_rw_1));
  tag_e1 inst83 (
    .in(inst134_out), .clk(clk), .UP(UP), .DOWN(DOWN), .ME_2(inst82_me_1), .AD_2(inst82_ad_1),
    .RW_2(inst82_rw_1), .io(inst136_out), .me(inst137_out), .addr(addr82), .out(out), .Q(Q),
    .ME_1(inst83_me_1), .AD_1(inst83_ad_1), .RW_1(inst83_rw_1));
  tag_e1 inst84 (
    .in(inst134_out), .clk(clk), .UP(UP), .DOWN(DOWN), .ME_2(inst83_me_1), .AD_2(inst83_ad_1),
    .RW_2(inst83_rw_1), .io(inst136_out), .me(inst137_out), .addr(addr83), .out(out), .Q(Q),
    .ME_1(inst84_me_1), .AD_1(inst84_ad_1), .RW_1(inst84_rw_1));
  tag_e1 inst85 (
    .in(inst134_out), .clk(clk), .UP(UP), .DOWN(DOWN), .ME_2(inst84_me_1), .AD_2(inst84_ad_1),
    .RW_2(inst84_rw_1), .io(inst136_out), .me(inst137_out), .addr(addr84), .out(out), .Q(Q),
    .ME_1(inst85_me_1), .AD_1(inst85_ad_1), .RW_1(inst85_rw_1));
  tag_e1 inst102 (
    .in(inst134_out), .clk(clk), .UP(UP), .DOWN(DOWN), .ME_2(inst85_me_1), .AD_2(inst85_ad_1),
    .RW_2(inst85_rw_1), .io(inst136_out), .me(inst137_out), .addr(addr85), .out(out), .Q(Q),
    .ME_1(inst102_me_1), .AD_1(inst102_ad_1), .RW_1(inst102_rw_1));
  tag_e1 inst86 (
    .in(inst134_out), .clk(clk), .UP(UP), .DOWN(DOWN), .ME_2(inst102_me_1), .AD_2(inst102_ad_1),
    .RW_2(inst102_rw_1), .io(inst136_out), .me(inst137_out), .addr(addr86), .out(out), .Q(Q),
    .ME_1(inst86_me_1), .AD_1(inst86_ad_1), .RW_1(inst86_rw_1));
  tag_e1 inst87 (
    .in(inst134_out), .clk(clk), .UP(UP), .DOWN(DOWN), .ME_2(inst86_me_1), .AD_2(inst86_ad_1),
    .RW_2(inst86_rw_1), .io(inst136_out), .me(inst137_out), .addr(addr87), .out(out), .Q(Q),
    .ME_1(inst87_me_1), .AD_1(inst87_ad_1), .RW_1(inst87_rw_1));
  tag_e1 inst88 (
    .in(inst134_out), .clk(clk), .UP(UP), .DOWN(DOWN), .ME_2(inst87_me_1), .AD_2(inst87_ad_1),
    .RW_2(inst87_rw_1), .io(inst136_out), .me(inst137_out), .addr(addr88), .out(out), .Q(Q),
    .ME_1(inst88_me_1), .AD_1(inst88_ad_1), .RW_1(inst88_rw_1));
  tag_e1 inst89 (
    .in(inst134_out), .clk(clk), .UP(UP), .DOWN(DOWN), .ME_2(inst88_me_1), .AD_2(inst88_ad_1),
    .RW_2(inst88_rw_1), .io(inst136_out), .me(inst137_out), .addr(addr89), .out(out), .Q(Q),
    .ME_1(inst89_me_1), .AD_1(inst89_ad_1), .RW_1(inst89_rw_1));
  tag_e1 inst90 (
    .in(inst134_out), .clk(clk), .UP(UP), .DOWN(DOWN), .ME_2(inst89_me_1), .AD_2(inst89_ad_1),
    .RW_2(inst89_rw_1), .io(inst136_out), .me(inst137_out), .addr(addr90), .out(out), .Q(Q),
    .ME_1(inst90_me_1), .AD_1(inst90_ad_1), .RW_1(inst90_rw_1));
  tag_e1 inst91 (
    .in(inst134_out), .clk(clk), .UP(UP), .DOWN(DOWN), .ME_2(inst90_me_1), .AD_2(inst90_ad_1),
    .RW_2(inst90_rw_1), .io(inst136_out), .me(inst137_out), .addr(addr91), .out(out), .Q(Q),
    .ME_1(inst91_me_1), .AD_1(inst91_ad_1), .RW_1(inst91_rw_1));
  tag_e1 inst92 (
    .in(inst134_out), .clk(clk), .UP(UP), .DOWN(DOWN), .ME_2(inst91_me_1), .AD_2(inst91_ad_1),
    .RW_2(inst91_rw_1), .io(inst136_out), .me(inst137_out), .addr(addr92), .out(out), .Q(Q),
    .ME_1(inst92_me_1), .AD_1(inst92_ad_1), .RW_1(inst92_rw_1));
  tag_e1 inst93 (
    .in(inst134_out), .clk(clk), .UP(UP), .DOWN(DOWN), .ME_2(inst92_me_1), .AD_2(inst92_ad_1),
    .RW_2(inst92_rw_1), .io(inst136_out), .me(inst137_out), .addr(addr93), .out(out), .Q(Q),
    .ME_1(inst93_me_1), .AD_1(inst93_ad_1), .RW_1(inst93_rw_1));
  tag_e1 inst94 (
    .in(inst134_out), .clk(clk), .UP(UP), .DOWN(DOWN), .ME_2(inst93_me_1), .AD_2(inst93_ad_1),
    .RW_2(inst93_rw_1), .io(inst136_out), .me(inst137_out), .addr(addr94), .out(out), .Q(Q),
    .ME_1(inst94_me_1), .AD_1(inst94_ad_1), .RW_1(inst94_rw_1));
  tag_e1 inst95 (
    .in(inst134_out), .clk(clk), .UP(UP), .DOWN(DOWN), .ME_2(inst94_me_1), .AD_2(inst94_ad_1),
    .RW_2(inst94_rw_1), .io(inst136_out), .me(inst137_out), .addr(addr95), .out(out), .Q(Q),
    .ME_1(inst95_me_1), .AD_1(inst95_ad_1), .RW_1(inst95_rw_1));
  tag_e1 inst96 (
    .in(inst134_out), .clk(clk), .UP(UP), .DOWN(DOWN), .ME_2(inst95_me_1), .AD_2(inst95_ad_1),
    .RW_2(inst95_rw_1), .io(inst136_out), .me(inst137_out), .addr(addr96), .out(out), .Q(Q),
    .ME_1(inst96_me_1), .AD_1(inst96_ad_1), .RW_1(inst96_rw_1));
  tag_e1 inst97 (
    .in(inst134_out), .clk(clk), .UP(UP), .DOWN(DOWN), .ME_2(inst96_me_1), .AD_2(inst96_ad_1),
    .RW_2(inst96_rw_1), .io(inst136_out), .me(inst137_out), .addr(addr97), .out(out), .Q(Q),
    .ME_1(inst97_me_1), .AD_1(inst97_ad_1), .RW_1(inst97_rw_1));
  tag_e1 inst98 (
    .in(inst134_out), .clk(clk), .UP(UP), .DOWN(DOWN), .ME_2(inst97_me_1), .AD_2(inst97_ad_1),
    .RW_2(inst97_rw_1), .io(inst136_out), .me(inst137_out), .addr(addr98), .out(out), .Q(Q),
    .ME_1(inst98_me_1), .AD_1(inst98_ad_1), .RW_1(inst98_rw_1));
  tag_e1 inst99 (
    .in(inst134_out), .clk(clk), .UP(UP), .DOWN(DOWN), .ME_2(inst98_me_1), .AD_2(inst98_ad_1),
    .RW_2(inst98_rw_1), .io(inst136_out), .me(inst137_out), .addr(addr99), .out(out), .Q(Q),
    .ME_1(inst99_me_1), .AD_1(inst99_ad_1), .RW_1(inst99_rw_1));
  tag_e1 inst100 (
    .in(inst134_out), .clk(clk), .UP(UP), .DOWN(DOWN), .ME_2(inst99_me_1), .AD_2(inst99_ad_1),
    .RW_2(inst99_rw_1), .io(inst136_out), .me(inst137_out), .addr(addr100), .out(out), .Q(Q),
    .ME_1(inst100_me_1), .AD_1(inst100_ad_1), .RW_1(inst100_rw_1));
  tag_e1 inst103 (
    .in(inst134_out), .clk(clk), .UP(UP), .DOWN(DOWN), .ME_2(inst100_me_1), .AD_2(inst100_ad_1),
    .RW_2(inst100_rw_1), .io(inst136_out), .me(inst137_out), .addr(addr101), .out(out), .Q(Q),
    .ME_1(inst103_me_1), .AD_1(inst103_ad_1), .RW_1(inst103_rw_1));
  tag_e1 inst126 (
    .in(inst134_out), .clk(clk), .UP(UP), .DOWN(DOWN), .ME_2(inst103_me_1), .AD_2(inst103_ad_1),
    .RW_2(inst103_rw_1), .io(inst136_out), .me(inst137_out), .addr(addr102), .out(out), .Q(Q),
    .ME_1(inst126_me_1), .AD_1(inst126_ad_1), .RW_1(inst126_rw_1));
  tag_e1 inst104 (
    .in(inst134_out), .clk(clk), .UP(UP), .DOWN(DOWN), .ME_2(inst126_me_1), .AD_2(inst126_ad_1),
    .RW_2(inst126_rw_1), .io(inst136_out), .me(inst137_out), .addr(addr103), .out(out), .Q(Q),
    .ME_1(inst104_me_1), .AD_1(inst104_ad_1), .RW_1(inst104_rw_1));
  tag_e1 inst105 (
    .in(inst134_out), .clk(clk), .UP(UP), .DOWN(DOWN), .ME_2(inst104_me_1), .AD_2(inst104_ad_1),
    .RW_2(inst104_rw_1), .io(inst136_out), .me(inst137_out), .addr(addr104), .out(out), .Q(Q),
    .ME_1(inst105_me_1), .AD_1(inst105_ad_1), .RW_1(inst105_rw_1));
  tag_e1 inst106 (
    .in(inst134_out), .clk(clk), .UP(UP), .DOWN(DOWN), .ME_2(inst105_me_1), .AD_2(inst105_ad_1),
    .RW_2(inst105_rw_1), .io(inst136_out), .me(inst137_out), .addr(addr105), .out(out), .Q(Q),
    .ME_1(inst106_me_1), .AD_1(inst106_ad_1), .RW_1(inst106_rw_1));
  tag_e1 inst107 (
    .in(inst134_out), .clk(clk), .UP(UP), .DOWN(DOWN), .ME_2(inst106_me_1), .AD_2(inst106_ad_1),
    .RW_2(inst106_rw_1), .io(inst136_out), .me(inst137_out), .addr(addr106), .out(out), .Q(Q),
    .ME_1(inst107_me_1), .AD_1(inst107_ad_1), .RW_1(inst107_rw_1));
  tag_e1 inst108 (
    .in(inst134_out), .clk(clk), .UP(UP), .DOWN(DOWN), .ME_2(inst107_me_1), .AD_2(inst107_ad_1),
    .RW_2(inst107_rw_1), .io(inst136_out), .me(inst137_out), .addr(addr107), .out(out), .Q(Q),
    .ME_1(inst108_me_1), .AD_1(inst108_ad_1), .RW_1(inst108_rw_1));
  tag_e1 inst109 (
    .in(inst134_out), .clk(clk), .UP(UP), .DOWN(DOWN), .ME_2(inst108_me_1), .AD_2(inst108_ad_1),
    .RW_2(inst108_rw_1), .io(inst136_out), .me(inst137_out), .addr(addr108), .out(out), .Q(Q),
    .ME_1(inst109_me_1), .AD_1(inst109_ad_1), .RW_1(inst109_rw_1));
  tag_e1 inst110 (
    .in(inst134_out), .clk(clk), .UP(UP), .DOWN(DOWN), .ME_2(inst109_me_1), .AD_2(inst109_ad_1),
    .RW_2(inst109_rw_1), .io(inst136_out), .me(inst137_out), .addr(addr109), .out(out), .Q(Q),
    .ME_1(inst110_me_1), .AD_1(inst110_ad_1), .RW_1(inst110_rw_1));
  tag_e1 inst127 (
    .in(inst134_out), .clk(clk), .UP(UP), .DOWN(DOWN), .ME_2(inst110_me_1), .AD_2(inst110_ad_1),
    .RW_2(inst110_rw_1), .io(inst136_out), .me(inst137_out), .addr(addr110), .out(out), .Q(Q),
    .ME_1(inst127_me_1), .AD_1(inst127_ad_1), .RW_1(inst127_rw_1));
  tag_e1 inst111 (
    .in(inst134_out), .clk(clk), .UP(UP), .DOWN(DOWN), .ME_2(inst127_me_1), .AD_2(inst127_ad_1),
    .RW_2(inst127_rw_1), .io(inst136_out), .me(inst137_out), .addr(addr111), .out(out), .Q(Q),
    .ME_1(inst111_me_1), .AD_1(inst111_ad_1), .RW_1(inst111_rw_1));
  tag_e1 inst112 (
    .in(inst134_out), .clk(clk), .UP(UP), .DOWN(DOWN), .ME_2(inst111_me_1), .AD_2(inst111_ad_1),
    .RW_2(inst111_rw_1), .io(inst136_out), .me(inst137_out), .addr(addr112), .out(out), .Q(Q),
    .ME_1(inst112_me_1), .AD_1(inst112_ad_1), .RW_1(inst112_rw_1));
  tag_e1 inst113 (
    .in(inst134_out), .clk(clk), .UP(UP), .DOWN(DOWN), .ME_2(inst112_me_1), .AD_2(inst112_ad_1),
    .RW_2(inst112_rw_1), .io(inst136_out), .me(inst137_out), .addr(addr113), .out(out), .Q(Q),
    .ME_1(inst113_me_1), .AD_1(inst113_ad_1), .RW_1(inst113_rw_1));
  tag_e1 inst114 (
    .in(inst134_out), .clk(clk), .UP(UP), .DOWN(DOWN), .ME_2(inst113_me_1), .AD_2(inst113_ad_1),
    .RW_2(inst113_rw_1), .io(inst136_out), .me(inst137_out), .addr(addr114), .out(out), .Q(Q),
    .ME_1(inst114_me_1), .AD_1(inst114_ad_1), .RW_1(inst114_rw_1));
  tag_e1 inst115 (
    .in(inst134_out), .clk(clk), .UP(UP), .DOWN(DOWN), .ME_2(inst114_me_1), .AD_2(inst114_ad_1),
    .RW_2(inst114_rw_1), .io(inst136_out), .me(inst137_out), .addr(addr115), .out(out), .Q(Q),
    .ME_1(inst115_me_1), .AD_1(inst115_ad_1), .RW_1(inst115_rw_1));
  tag_e1 inst116 (
    .in(inst134_out), .clk(clk), .UP(UP), .DOWN(DOWN), .ME_2(inst115_me_1), .AD_2(inst115_ad_1),
    .RW_2(inst115_rw_1), .io(inst136_out), .me(inst137_out), .addr(addr116), .out(out), .Q(Q),
    .ME_1(inst116_me_1), .AD_1(inst116_ad_1), .RW_1(inst116_rw_1));
  tag_e1 inst117 (
    .in(inst134_out), .clk(clk), .UP(UP), .DOWN(DOWN), .ME_2(inst116_me_1), .AD_2(inst116_ad_1),
    .RW_2(inst116_rw_1), .io(inst136_out), .me(inst137_out), .addr(addr117), .out(out), .Q(Q),
    .ME_1(inst117_me_1), .AD_1(inst117_ad_1), .RW_1(inst117_rw_1));
  tag_e1 inst118 (
    .in(inst134_out), .clk(clk), .UP(UP), .DOWN(DOWN), .ME_2(inst117_me_1), .AD_2(inst117_ad_1),
    .RW_2(inst117_rw_1), .io(inst136_out), .me(inst137_out), .addr(addr118), .out(out), .Q(Q),
    .ME_1(inst118_me_1), .AD_1(inst118_ad_1), .RW_1(inst118_rw_1));
  tag_e1 inst119 (
    .in(inst134_out), .clk(clk), .UP(UP), .DOWN(DOWN), .ME_2(inst118_me_1), .AD_2(inst118_ad_1),
    .RW_2(inst118_rw_1), .io(inst136_out), .me(inst137_out), .addr(addr119), .out(out), .Q(Q),
    .ME_1(inst119_me_1), .AD_1(inst119_ad_1), .RW_1(inst119_rw_1));
  tag_e1 inst120 (
    .in(inst134_out), .clk(clk), .UP(UP), .DOWN(DOWN), .ME_2(inst119_me_1), .AD_2(inst119_ad_1),
    .RW_2(inst119_rw_1), .io(inst136_out), .me(inst137_out), .addr(addr120), .out(out), .Q(Q),
    .ME_1(inst120_me_1), .AD_1(inst120_ad_1), .RW_1(inst120_rw_1));
  tag_e1 inst121 (
    .in(inst134_out), .clk(clk), .UP(UP), .DOWN(DOWN), .ME_2(inst120_me_1), .AD_2(inst120_ad_1),
    .RW_2(inst120_rw_1), .io(inst136_out), .me(inst137_out), .addr(addr121), .out(out), .Q(Q),
    .ME_1(inst121_me_1), .AD_1(inst121_ad_1), .RW_1(inst121_rw_1));
  tag_e1 inst122 (
    .in(inst134_out), .clk(clk), .UP(UP), .DOWN(DOWN), .ME_2(inst121_me_1), .AD_2(inst121_ad_1),
    .RW_2(inst121_rw_1), .io(inst136_out), .me(inst137_out), .addr(addr122), .out(out), .Q(Q),
    .ME_1(inst122_me_1), .AD_1(inst122_ad_1), .RW_1(inst122_rw_1));
  tag_e1 inst123 (
    .in(inst134_out), .clk(clk), .UP(UP), .DOWN(DOWN), .ME_2(inst122_me_1), .AD_2(inst122_ad_1),
    .RW_2(inst122_rw_1), .io(inst136_out), .me(inst137_out), .addr(addr123), .out(out), .Q(Q),
    .ME_1(inst123_me_1), .AD_1(inst123_ad_1), .RW_1(inst123_rw_1));
  tag_e1 inst124 (
    .in(inst134_out), .clk(clk), .UP(UP), .DOWN(DOWN), .ME_2(inst123_me_1), .AD_2(inst123_ad_1),
    .RW_2(inst123_rw_1), .io(inst136_out), .me(inst137_out), .addr(addr124), .out(out), .Q(Q),
    .ME_1(inst124_me_1), .AD_1(inst124_ad_1), .RW_1(inst124_rw_1));
  tag_e1 inst125 (
    .in(inst134_out), .clk(clk), .UP(UP), .DOWN(DOWN), .ME_2(inst124_me_1), .AD_2(inst124_ad_1),
    .RW_2(inst124_rw_1), .io(inst136_out), .me(inst137_out), .addr(addr125), .out(out), .Q(Q),
    .ME_1(inst125_me_1), .AD_1(inst125_ad_1), .RW_1(inst125_rw_1));
  tag_e1 inst128 (
    .in(inst134_out), .clk(clk), .UP(UP), .DOWN(DOWN), .ME_2(inst125_me_1), .AD_2(inst125_ad_1),
    .RW_2(inst125_rw_1), .io(inst136_out), .me(inst137_out), .addr(addr126), .out(out), .Q(Q),
    .ME_1(inst128_me_1), .AD_1(inst128_ad_1), .RW_1(inst128_rw_1));
  tag_e1 inst129 (
    .in(inst134_out), .clk(clk), .UP(UP), .DOWN(DOWN), .ME_2(inst128_me_1), .AD_2(inst128_ad_1),
    .RW_2(inst128_rw_1), .io(inst136_out), .me(inst137_out), .addr(addr127), .out(out), .Q(Q),
    .ME_1(inst129_me_1), .AD_1(inst129_ad_1), .RW_1(inst129_rw_1));
  TRI inst130[7:0] (.IN(out), .OE(inst131_out), .OUT(inst134_out));
endmodule
